# EAGLE design AtxPowerDispatcher (EAGLE 6.1)
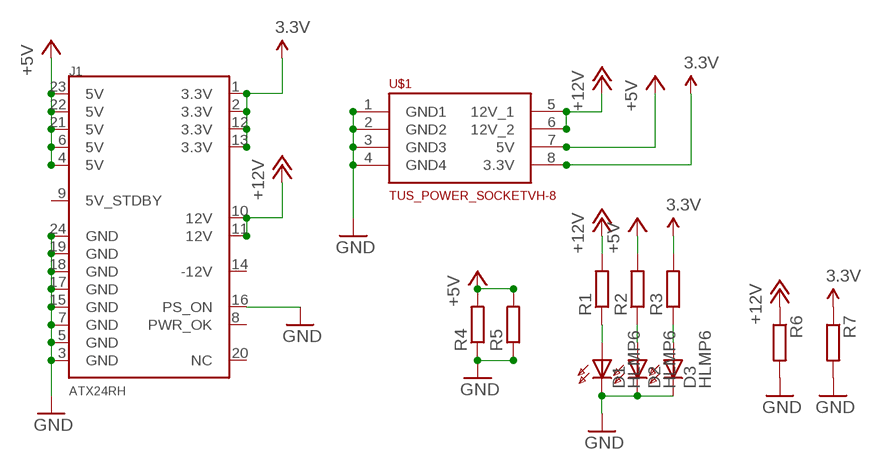
[diagram p0: schematic, sheet 1]

## Parts
D1  HLMP6  [HLMP6]
D2  HLMP6  [HLMP6]
D3  HLMP6  [HLMP6]
J1  ATX24RH  [ATX24_RIGHT_ANGLE]
R1  R-EU_0207/7  [0207/7]
R2  R-EU_0207/7  [0207/7]
R3  R-EU_0207/7  [0207/7]
R4  R-EU_0922/22  [0922/22]
R5  R-EU_0922/22  [0922/22]
R6  R-EU_0414/15  [0414/15]
R7  R-EU_0414/15  [0414/15]
U$1  TUS_POWER_SOCKETVH-8  [VH_8]

## Nets
3.3V: J1.1(3.3V) J1.2(3.3V) J1.12(3.3V) J1.13(3.3V) R3.2 R7.1 U$1.8(3.3V)
+5V: J1.4(5V) J1.6(5V) J1.21(5V) J1.22(5V) J1.23(5V) R2.2 R4.2 R5.2 U$1.7(5V)
+12V: J1.10(12V) J1.11(12V) R1.2 R6.1 U$1.5(12V_1) U$1.6(12V_2)
GND: D1.K D2.K D3.K J1.3(GND) J1.5(GND) J1.7(GND) J1.15(GND) J1.16(PS_ON) J1.17(GND) J1.18(GND) J1.19(GND) J1.24(GND) R4.1 R5.1 R6.2 R7.2 U$1.1(GND1) U$1.2(GND2) U$1.3(GND3) U$1.4(GND4)
N$1: D1.A R1.1
N$4: D2.A R2.1
N$5: D3.A R3.1
Unconnected: J1.8(PWR_OK) J1.9(5V_STDBY) J1.14(-12V) J1.20(NC)

## Library data of the parts
D1-D3 = display-hp:HLMP6: LED 2mm horizontal; MF: AGILENT TECHNOLOGIES; MPN: HLMP-6500; OC_FARNELL: 1652490; OC_NEWARK: 40K0088
J1 = SparkFun:ATX24: ATX24 Pin Power Supply Connector This is a good connector for connecting a computer power supply to a PCB. It's massive, but provides many amps of power at 5V and 12V. SKU: PRT-09498
R1-R3 R6 R7 = rcl:R-EU_: RESISTOR, European symbol
R4 R5 = resistor:R-EU_: RESISTOR, European symbol
U$1 = myparts:TUS_POWER_SOCKET

## Board
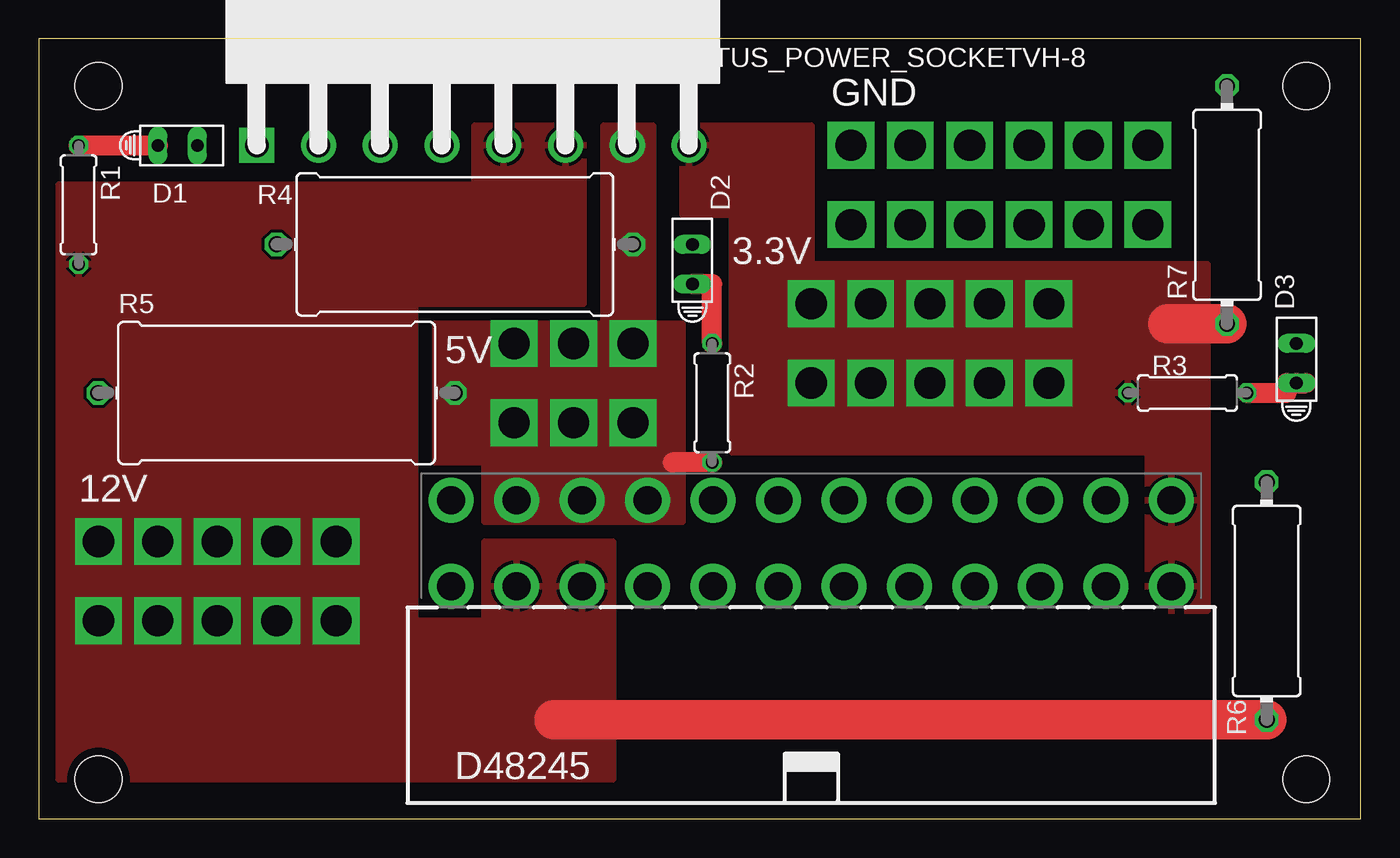
[diagram p1: board, top side]
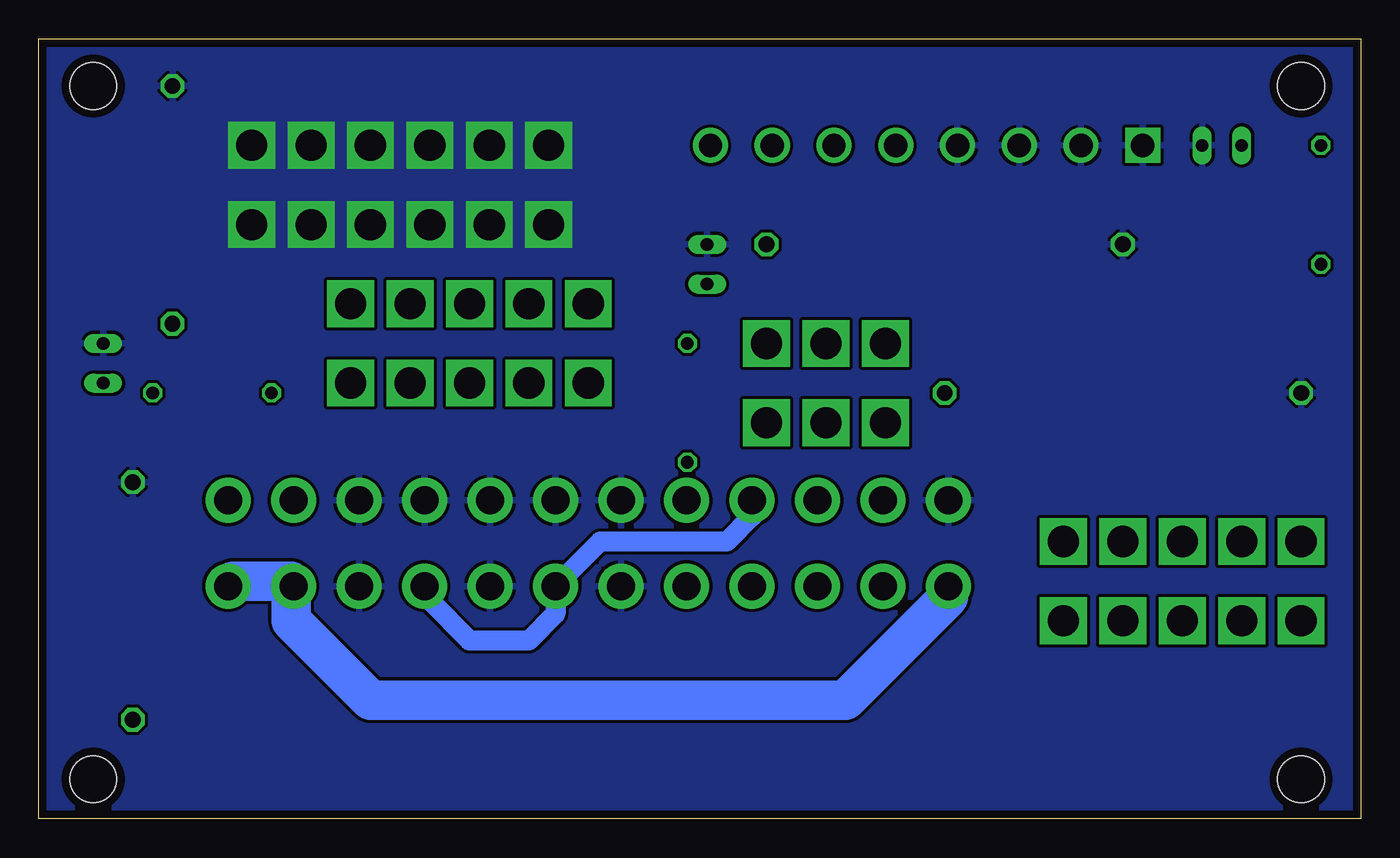
[diagram p2: board, bottom side, seen from below]

Size 84.76 x 50 mm. Coordinates in mm from the lower left corner, seen from the top.
Outline: 0,0 84.76,0 84.76,50 0,50 0,0
Copper layers (1*16): Top 0.035mm / dielectric 1.5mm / Bottom 0.035mm
Design rules: minimum track width 8mil, minimum drill 0.4mm, track to track 8mil, track to pad 8mil, pad to pad 8mil, via to via 8mil, smd to smd 8mil, copper to edge 20mil, drill to drill 8mil, minimum pad ring 8mil, minimum via ring 10mil, stop-mask expansion 3mil, vias tented up to drill 0mil, thermal gap 8mil
Holes 3 mm at 3.81,46.99 3.81,2.54 81.28,2.54 81.28,46.99

### Footprints (pad centres in the part's own frame; a part is rotated, then mirrored left to right if it is on the bottom)
HLMP6 = drill 0.813 long: A -1.27,0; K 1.27,0
ATX24_RIGHT_ANGLE = drill 1.8 pad 2.9: 1 23.1,4.76; 2 18.9,4.76; 3 14.7,4.76; 4 10.5,4.76; 5 6.3,4.76; 6 2.1,4.76; 7 -2.1,4.76; 8 -6.3,4.76; 9 -10.5,4.76; 10 -14.7,4.76; 11 -18.9,4.76; 12 -23.1,4.76; 13 23.1,10.26; 14 18.9,10.26; 15 14.7,10.26; 16 10.5,10.26; 17 6.3,10.26; 18 2.1,10.26; 19 -2.1,10.26; 20 -6.3,10.26; 21 -10.5,10.26; 22 -14.7,10.26; 23 -18.9,10.26; 24 -23.1,10.26
0207/7 = drill 0.813 octagon: 1 -3.81,0; 2 3.81,0
0922/22 = drill 1.016 octagon: 1 -11.43,0; 2 11.43,0
0414/15 = drill 1.016 octagon: 1 -7.62,0; 2 7.62,0
VH_8 = drill 1.5 square: 1 0,0 | drill 1.5: 2 3.96,0; 3 7.92,0; 4 11.88,0; 5 15.84,0; 6 19.8,0; 7 23.76,0; 8 27.72,0

### Placement (x,y rotation side)
D1  8.89,43.18 0 top
D2  41.91,35.56 90 top
D3  80.64,29.21 90 top
J1  49.53,10.16 0 top
R1  2.54,39.37 270 top
R2  43.18,26.67 270 top
R3  73.66,27.3 180 top
R4  26.67,36.83 0 top
R5  15.24,27.3 0 top
R6  78.74,13.97 90 top
R7  76.2,39.37 90 top
U$1  13.97,43.18 0 top

### Tracks (layer width: path | path; a pad name or v marks a point on that pad's centre or on a via)
3.3V  (via drill 2)
  Top 2.54: R7.1 72.39,31.75
  Bottom 1.27: J1.1 J1.2
  Bottom 2.54: J1.12 26.43,14.21 33.02,7.62 63.5,7.62 68.58,12.7 68.58,15.24 72.31,15.24 J1.1
  other vias: 49.53,33.02 53.34,33.02 57.15,33.02 60.96,33.02 64.77,33.02 49.53,27.94 53.34,27.94 57.15,27.94 60.96,27.94 64.77,27.94
  pour Top: 71.12,13.34 74.93,13.34 74.93,35.56 49.53,35.56 49.53,44.45 41.27,44.45 41.27,38.73 44.45,38.73 44.45,23.5 71.12,23.5
+5V  (via drill 2)
  Top 1.27: 38.1,43.18 U$1.7 | R2.2 40.64,22.86
  Bottom 1.27: J1.21 39.03,19.39 40.64,17.78 48.77,17.78 J1.6 51.63,13.14 53.34,11.43 57.15,11.43 59.69,13.97 59.69,14.58 J1.4
  other vias: 30.48,30.48 34.29,30.48 38.1,30.48 38.1,25.4 34.29,25.4 30.48,25.4
  pour Top (no thermals): 28.57,19.05 28.57,22.86 25.4,22.86 25.4,31.75 36.2,31.75 36.2,44.45 39.37,44.45 39.37,31.75 41.27,31.75 41.27,19.05
+12V  (via drill 2)
  Top 2.54: R6.1 33.02,6.35
  other vias: 3.81,17.78 7.62,17.78 11.43,17.78 15.24,17.78 19.05,17.78 3.81,12.7 7.62,12.7 11.43,12.7 15.24,12.7 19.05,12.7
  pour Top: 27.94,44.45 27.94,40.64 1.27,40.64 1.27,2.54 36.83,2.54 36.83,17.78 28.57,17.78 28.57,12.7 24.13,12.7 24.13,33.02 34.92,33.02 34.92,44.45
GND  (via drill 2)
  other vias: 71.12,43.18 67.31,43.18 63.5,43.18 59.69,43.18 55.88,43.18 52.07,43.18 52.07,38.1 55.88,38.1 59.69,38.1 63.5,38.1 67.31,38.1 71.12,38.1
  pour Bottom: 0,50.8 0,-1.27 101.6,-1.27 101.6,50.8
N$1
  Top 1.27: R1.1 D1.A
N$4
  Top 1.27: R2.1 43.18,34.29 D2.A
N$5
  Top 1.27: R3.1 80.01,27.3 80.01,27.94 D3.A 81.28,27.94

### Text on the board
tPlace: GND
tNames: 3.3V | 5V | 12V | D48245